# Altium schematic sheet Sheet.SchDoc
size A4; Organization: Altium Limited; Address1: L3, 12a Rodborough Rd; Address2: Frenchs Forest; Address3: NSW; Address4: Australia 2086; SheetNumber: 1; SheetTotal: 1
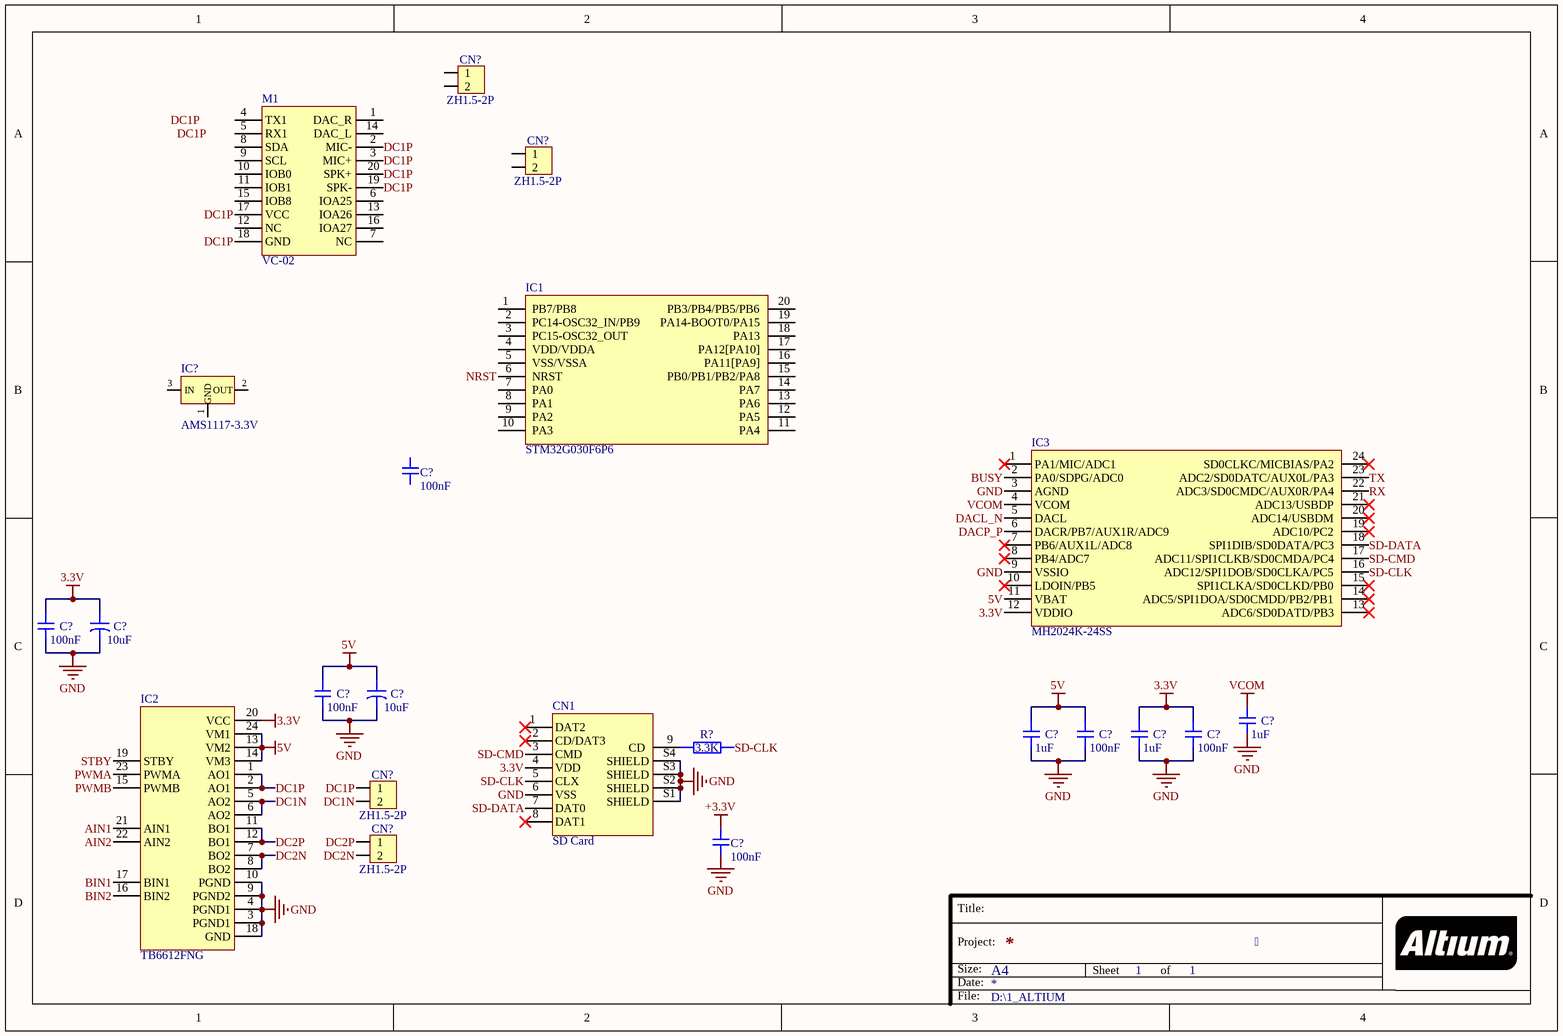
[diagram p0: Sheet.SchDoc]

## Parts
(Parts that share a designator on the sheet are numbered #1, #2 ... from top to bottom, then left to right.)
C?#1  100nF  [CAP-0402]
C?#2  10uF  [CASE-A-3216-18(mm) - 1]
C?#3  100nF  [CAP-0402]
C?#4  10uF  [CASE-A-3216-18(mm) - 1]
C?#5  1uF  [CAP-0402]
C?#6  100nF  [CAP-0402]
C?#7  1uF  [CAP-0402]
C?#8  1uF  [CAP-0402]
C?#9  100nF  [CAP-0402]
C?#10  100nF  [CAP-0402]
C?#11  100nF  [CAP-0402]
CN1  SD Card  [SMD-SD CARD]
CN?#1  ZH1.5-2P  [Plugin,P=1.5mm,2P]
CN?#2  ZH1.5-2P  [Plugin,P=1.5mm,2P]
CN?#3  ZH1.5-2P  [Plugin,P=1.5mm,2P]
CN?#4  ZH1.5-2P  [Plugin,P=1.5mm,2P]
IC1  STM32G030F6P6  [TSSOP-20]
IC2  TB6612FNG  [SSOP-24]
IC3  MH2024K-24SS  [QSOP-24]
IC?  AMS1117-3.3V  [SOT-89]
M1  VC-02  [SMD,17x18mm(VC-02)]
R?  3.3K  [RES-0603]

## Nets
3.3V: C?#2.1 C?#3.1 C?#8.1 C?#10.1 CN1.4(VDD) IC2.20(VCC) IC3.12(VDDIO)
5V: C?#4.1 C?#6.1 C?#7.1 C?#9.1 IC2.13(VM2) IC2.14(VM3) IC2.24(VM1) IC3.11(VBAT)
+3.3V: C?#11.1
GND: C?#2.2 C?#3.2 C?#4.2 C?#5.2 C?#6.2 C?#7.2 C?#8.2 C?#9.2 C?#10.2 C?#11.2 CN1.6(VSS) CN1.S1(SHIELD) CN1.S2(SHIELD) CN1.S3(SHIELD) CN1.S4(SHIELD) IC2.3(PGND1) IC2.4(PGND1) IC2.9(PGND2) IC2.10(PGND) IC2.18(GND) IC3.3(AGND) IC3.9(VSSIO)
VCOM: C?#5.1 IC3.4(VCOM)
AIN1: IC2.21(AIN1)
AIN2: IC2.22(AIN2)
BIN1: IC2.17(BIN1)
BIN2: IC2.16(BIN2)
BUSY: IC3.2(PA0/SDPG/ADC0)
DACL_N: IC3.5(DACL)
DACP_P: IC3.6(DACR/PB7/AUX1R/ADC9)
DC1N: CN?#3.2 IC2.5(AO2) IC2.6(AO2)
DC1P: CN?#3.1 IC2.1(AO1) IC2.2(AO1) M1.2(MIC-) M1.3(MIC+) M1.17(VCC) M1.18(GND) M1.19(SPK-) M1.20(SPK+)
DC2N: CN?#4.2 IC2.7(BO2) IC2.8(BO2)
DC2P: CN?#4.1 IC2.11(BO1) IC2.12(BO1)
NRST: IC1.6(NRST)
PWMA: IC2.23(PWMA)
PWMB: IC2.15(PWMB)
RX: IC3.22(ADC3/SD0CMDC/AUX0R/PA4)
SD-CLK: CN1.5(CLX) IC3.16(ADC12/SPI1DOB/SD0CLKA/PC5) R?.1
SD-CMD: CN1.3(CMD) IC3.17(ADC11/SPI1CLKB/SD0CMDA/PC4)
SD-DATA: CN1.7(DAT0) IC3.18(SPI1DIB/SD0DATA/PC3)
STBY: IC2.19(STBY)
TX: IC3.23(ADC2/SD0DATC/AUX0L/PA3)
NetCN1_9: CN1.9(CD) R?.2

Not connected (* = marked no-connect by the designer): C?#1 1 2; CN1 1(DAT2)* 2(CD/DAT3)* 8(DAT1)*; CN?#1 1 2; CN?#2 1 2; IC1 1(PB7/PB8) 2(PC14-OSC32_IN/PB9) 3(PC15-OSC32_OUT) 4(VDD/VDDA) 5(VSS/VSSA) 7(PA0) 8(PA1) 9(PA2) 10(PA3) 11(PA4) 12(PA5) 13(PA6) 14(PA7) 15(PB0/PB1/PB2/PA8) 16(PA11[PA9]) 17(PA12[PA10]) 18(PA13) 19(PA14-BOOT0/PA15) 20(PB3/PB4/PB5/PB6); IC3 1(PA1/MIC/ADC1_)* 7(PB6/AUX1L/ADC8)* 8(PB4/ADC7)* 10(LDOIN/PB5)* 13(ADC6/SD0DATD/PB3)* 14(ADC5/SPI1DOA/SD0CMDD/PB2/PB1)* 15(SPI1CLKA/SD0CLKD/PB0)* 19(ADC10/PC2)* 20(ADC14/USBDM)* 21(ADC13/USBDP)* 24(SD0CLKC/MICBIAS/PA2)*; IC? 1(GND) 2(OUT) 3(IN); M1 1(DAC_R) 4(TX1) 5(RX1) 6(IOA25) 7(NC) 8(SDA) 9(SCL) 10(IOB0) 11(IOB1) 12(NC) 13(IOA26) 14(DAC_L) 15(IOB8) 16(IOA27)

## Notes on the sheet
- Labels drawn without touching a wire or pin: DC1P
- Title:
- Size:
- Date:
- Project:
- A4
- Sheet
- of
- File:
- D:\1_ALTIUM

## Library data of the parts
C?#1 C?#3 C?#6 C?#9-C?#11 = CC0402KRX7R7BB104: 16V 100nF X7R ±10% 0402 Multilayer Ceramic Capacitors MLCC - SMD/SMT ROHS; Manufacturer: YAGEO; Package: 0402; Mfr.Part #: CC0402KRX7R7BB104; LCSC Part #: C60474
C?#2 C?#4 = TAJA106K016RNJ: 10uF 16V 3Ω@100kHz ±10% CASE-A-3216-18(mm) Tantalum Capacitors ROHS; Manufacturer: Kyocera AVX; Mfr.Part #: TAJA106K016RNJ; Package: CASE-A-3216-18(mm); LCSC Part #: C7171; DigiKey Part Number: 478-1655-2-ND
C?#5 C?#7 C?#8 = CL05A105KO5NNNC: 16V 1uF X5R ±10% 0402 Ceramic Capacitors ROHS; Manufacturer: Samsung Electro-Mechanics; Package: 0402; LCSC Part #: C29266; Mfr.Part #: CL05A105KO5NNNC; DigiKey Part Number: 1276-1067-2-ND
CN1 = TF PUSH: -25℃~+90℃ Push-Push 2mm Connector and Ejector MicroSD Card (TF Card) SMD PC Card Sockets ROHS; Manufacturer: SHOU HAN; Mfr.Part #: TF PUSH; LCSC Part #: C393941; Package: SMD
CN?#1-CN?#4 = BX-ZH1.5-2PZZ: 1x3P 3P ZH Tin 3 -25℃~+85℃ 1A 1 1.5mm Brass Straight Plugin,P=1.5mm Wire To Board Connector ROHS; Manufacturer: Bossie; Mfr.Part #: BX-ZH1.5-2PZZ; Package: Through Hole,P=1.5mm; LCSC Part #: C18077727
IC1 = STM32G030F6P6: ARM-M0 64MHz 18 TSSOP-20 Microcontrollers ROHS; Manufacturer: ST; So_Chna_Cam: 0; Mfr.Part #: STM32G030F6P6; Package: TSSOP-20; LCSC Part #: C724040; DigiKey Part Number: 497-STM32G030F6P6-ND; Link: https://www.lcsc.com/product-detail/Audio-Amplifiers_Jiaxing-Heroic-Elec-Tech-HT6818_C130782.html
IC2 = TB6612FNG: 1A Brush DC Motor 2.7V~5.5V Parallel SSOP-24 Motor Driver ICs ROHS; Manufacturer: TOSHIBA; Mfr.Part #: TB6612FNG,C,8,EL; Package: SSOP-24; LCSC Part #: C141517; DigiKey Part Number: TB6612FNGC8ELTR-ND
IC3 = MH2024K-24SS: Compact MP3/WAV/WMA audio decoder module with built-in amplifier and TF/USB support for embedded systems and microcontroller projects.; Manufacturer: GD; Package: QSOP24
IC? = AMS1117-3.3V-JSM: 1.2A Fixed 3.3V Positive electrode 15V SOT-89 Voltage Regulators - Linear, Low Drop Out (LDO) Regulators ROHS; Manufacturer: MSKSEMI; So_Chan_Dan: 3; So_Chan_Cam: 0; Mfr.Part #: AMS1117-3.3V-JSM; Name: AMS1117-3.3V; ComponentLink1Description: New link; ComponentLink1URL: https://www.lcsc.com/datasheet/lcsc_datasheet_2311231510_MSKSEMI-AMS1117-5-0V_C7473143.pdf; Package: SOT-89
M1 = VC-02_EN: RF TXRX MODULE OFFLINE VOICE SMD; Manufacturer: Ai-Thinker; Mfr.Part #: VC-02_EN; Package: SMD,17x18mm; DigiKey Part Number: 4570-VC-02TR-ND; LCSC Part #: C3039678
R? = RC0603FR-073K3L: 100mW Thick Film Resistor 75V ±100ppm/℃ ±1% 3.3kΩ 0603 Chip Resistor - Surface Mount ROHS; Manufacturer: YAGEO; Mfr.Part #: RC0603FR-073K3L; Package: 0603; LCSC Part #: C108078